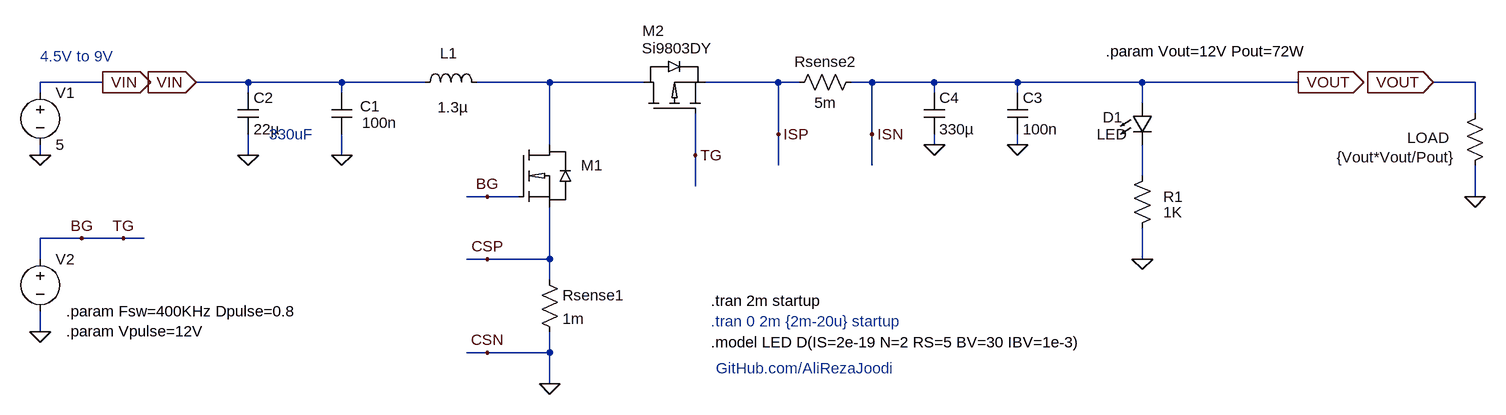
[diagram p0: schematic _PowerStage_PMOS.asc]
_PowerStage_PMOS.asc, the LTspice schematic file:
Version 4.1
SHEET 1 3476 1972
WIRE 1120 -464 1024 -464
WIRE 1344 -464 1264 -464
WIRE 1488 -464 1344 -464
WIRE 1616 -464 1488 -464
WIRE 1808 -464 1696 -464
WIRE 1952 -464 1808 -464
WIRE 2160 -464 2048 -464
WIRE 2192 -464 2160 -464
WIRE 2304 -464 2272 -464
WIRE 2400 -464 2304 -464
WIRE 2528 -464 2400 -464
WIRE 2720 -464 2528 -464
WIRE 2960 -464 2720 -464
WIRE 3232 -464 3168 -464
WIRE 1024 -448 1024 -464
WIRE 1344 -448 1344 -464
WIRE 1488 -448 1488 -464
WIRE 2400 -448 2400 -464
WIRE 2528 -448 2528 -464
WIRE 2720 -432 2720 -464
WIRE 3232 -416 3232 -464
WIRE 2160 -384 2160 -464
WIRE 2304 -384 2304 -464
WIRE 1808 -368 1808 -464
WIRE 2400 -368 2400 -384
WIRE 2528 -368 2528 -384
WIRE 1024 -352 1024 -368
WIRE 1344 -352 1344 -384
WIRE 1488 -352 1488 -384
WIRE 2032 -352 2032 -416
WIRE 2160 -336 2160 -384
WIRE 2304 -336 2304 -384
WIRE 2720 -320 2720 -368
WIRE 2032 -304 2032 -352
WIRE 1712 -288 1680 -288
WIRE 1760 -288 1712 -288
WIRE 3232 -288 3232 -336
WIRE 1088 -224 1024 -224
WIRE 1152 -224 1088 -224
WIRE 1184 -224 1152 -224
WIRE 1024 -192 1024 -224
WIRE 1712 -192 1680 -192
WIRE 1808 -192 1808 -272
WIRE 1808 -192 1712 -192
WIRE 2720 -192 2720 -240
WIRE 1808 -160 1808 -192
WIRE 1024 -80 1024 -112
WIRE 1712 -48 1680 -48
WIRE 1808 -48 1808 -80
WIRE 1808 -48 1712 -48
WIRE 1808 0 1808 -48
FLAG 1024 -80 0
FLAG 1152 -224 TG
FLAG 1088 -224 BG
FLAG 2400 -368 0
FLAG 3232 -288 0
FLAG 1024 -352 0
FLAG 2960 -464 VOUT
IOPIN 2960 -464 Out
FLAG 1120 -464 VIN
IOPIN 1120 -464 Out
FLAG 1488 -352 0
FLAG 2528 -368 0
FLAG 1712 -288 BG
FLAG 1344 -352 0
FLAG 1808 0 0
FLAG 1264 -464 VIN
IOPIN 1264 -464 In
FLAG 3168 -464 VOUT
IOPIN 3168 -464 In
FLAG 1712 -48 CSN
FLAG 2032 -352 TG
FLAG 1712 -192 CSP
FLAG 2160 -384 ISP
FLAG 2304 -384 ISN
FLAG 2720 -192 0
SYMBOL voltage 1024 -208 R0
WINDOW 3 41 64 Invisible 2
WINDOW 123 0 0 Left 0
WINDOW 39 0 0 Left 0
SYMATTR Value PULSE(0 {Vpulse} 0 {0.01/Fsw} {0.01/Fsw} {Dpulse/Fsw} {1/Fsw})
SYMATTR InstName V2
SYMBOL ind 1600 -448 R270
WINDOW 0 45 53 VTop 2
WINDOW 3 -7 59 VBottom 2
SYMATTR InstName L1
SYMATTR Value 1.3µ
SYMATTR SpiceLine Rser=13.1m
SYMBOL voltage 1024 -464 R0
WINDOW 123 24 138 Left 2
WINDOW 39 24 117 Left 2
SYMATTR Value 5
SYMATTR InstName V1
SYMBOL res 3248 -432 M0
WINDOW 0 55 53 Left 2
WINDOW 3 48 83 Left 2
SYMATTR InstName LOAD
SYMATTR Value {Vout*Vout/Pout}
SYMBOL cap 1472 -448 R0
WINDOW 0 44 21 Left 2
WINDOW 3 47 46 Left 2
SYMATTR InstName C1
SYMATTR Value 100n
SYMBOL cap 1328 -448 R0
SYMATTR InstName C2
SYMATTR Value 22µ
SYMBOL cap 2512 -448 R0
SYMATTR InstName C3
SYMATTR Value 100n
SYMBOL cap 2384 -448 R0
SYMATTR InstName C4
SYMATTR Value 330µ
SYMBOL MyLib\\Transistor_MOSFET_N\\MOSFET_N 1760 -368 R0
WINDOW 3 96 56 Invisible 2
SYMATTR Value Si7370DP
SYMATTR InstName M1
SYMBOL res 1792 -176 R0
SYMATTR InstName Rsense1
SYMATTR Value 1m
SYMBOL res 2176 -448 R270
WINDOW 0 32 56 VTop 2
WINDOW 3 0 56 VBottom 2
SYMATTR InstName Rsense2
SYMATTR Value 5m
SYMBOL MyLib\\Transistor_MOSFET_P\\MOSFET_P 2048 -416 M270
WINDOW 0 127 97 VLeft 2
WINDOW 3 100 98 VLeft 2
SYMATTR InstName M2
SYMATTR Value Si9803DY
SYMBOL LED 2704 -432 R0
WINDOW 0 -45 22 Left 2
WINDOW 3 -54 48 Left 2
SYMATTR InstName D1
SYMATTR Value LED
SYMBOL res 2704 -224 M180
WINDOW 0 48 64 Left 2
WINDOW 3 48 40 Left 2
SYMATTR InstName R1
SYMATTR Value 1K
TEXT 2056 -128 Left 2 !.tran 2m startup
TEXT 2064 -24 Left 2 ;GitHub.com/AliRezaJoodi
TEXT 1064 -112 Left 2 !.param Fsw=400KHz Dpulse=0.8\n.param Vpulse=12V
TEXT 2056 -96 Left 2 ;.tran 0 2m {2m-20u} startup
TEXT 2664 -512 Left 2 !.param Vout=12V Pout=72W
TEXT 1376 -384 Left 2 ;330uF
TEXT 1024 -504 Left 2 ;4.5V to 9V
TEXT 2056 -64 Left 2 !.model LED D(IS=2e-19 N=2 RS=5 BV=30 IBV=1e-3)

The netlist it stands for:
* _PowerStage_PMOS.asc
V2 BG 0 PULSE(0 {Vpulse} 0 {0.01/Fsw} {0.01/Fsw} {Dpulse/Fsw} {1/Fsw})
L1 VIN N001 1.3µ Rser=13.1m
V1 VIN 0 5
R§LOAD ISN 0 {Vout*Vout/Pout}
C1 VIN 0 100n
C2 VIN 0 22µ
C3 ISN 0 100n
C4 ISN 0 330µ
M1 N001 BG CSP CSP Si7370DP
Rsense1 CSP 0 1m
Rsense2 ISP ISN 5m
M2 N001 BG ISP ISP Si9803DY
D1 ISN N002 LED
R1 0 N002 1K
.model D D
.lib standard.dio
.model NMOS NMOS
.model PMOS PMOS
.lib standard.mos
.tran 2m startup
* GitHub.com/AliRezaJoodi
.param Fsw=400KHz Dpulse=0.8
.param Vpulse=12V
* .tran 0 2m {2m-20u} startup
.param Vout=12V Pout=72W
* 330uF
* 4.5V to 9V
.model LED D(IS=2e-19 N=2 RS=5 BV=30 IBV=1e-3)
.backanno
.end